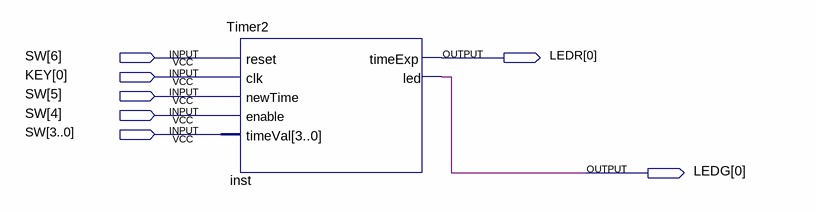
[diagram p0: schematic sheet]
// Quartus schematic Timer2_Block.bdf as structural Verilog: 1 symbols, 7 pins
module Timer2_Block (
  input  [6:0] SW,
  input  [0:0] KEY,
  output [0:0] LEDR,
  output [0:0] LEDG
);

  Timer2 inst (
    .reset(SW[6]), .clk(KEY[0]), .newTime(SW[5]), .enable(SW[4]), .timeVal(SW[3:0]), .timeExp(LEDR[0]),
    .led(LEDG[0]));
endmodule
